# EasyEDA Pro project ProPrj_MN42_2025-04-03.epro, board btnBRD
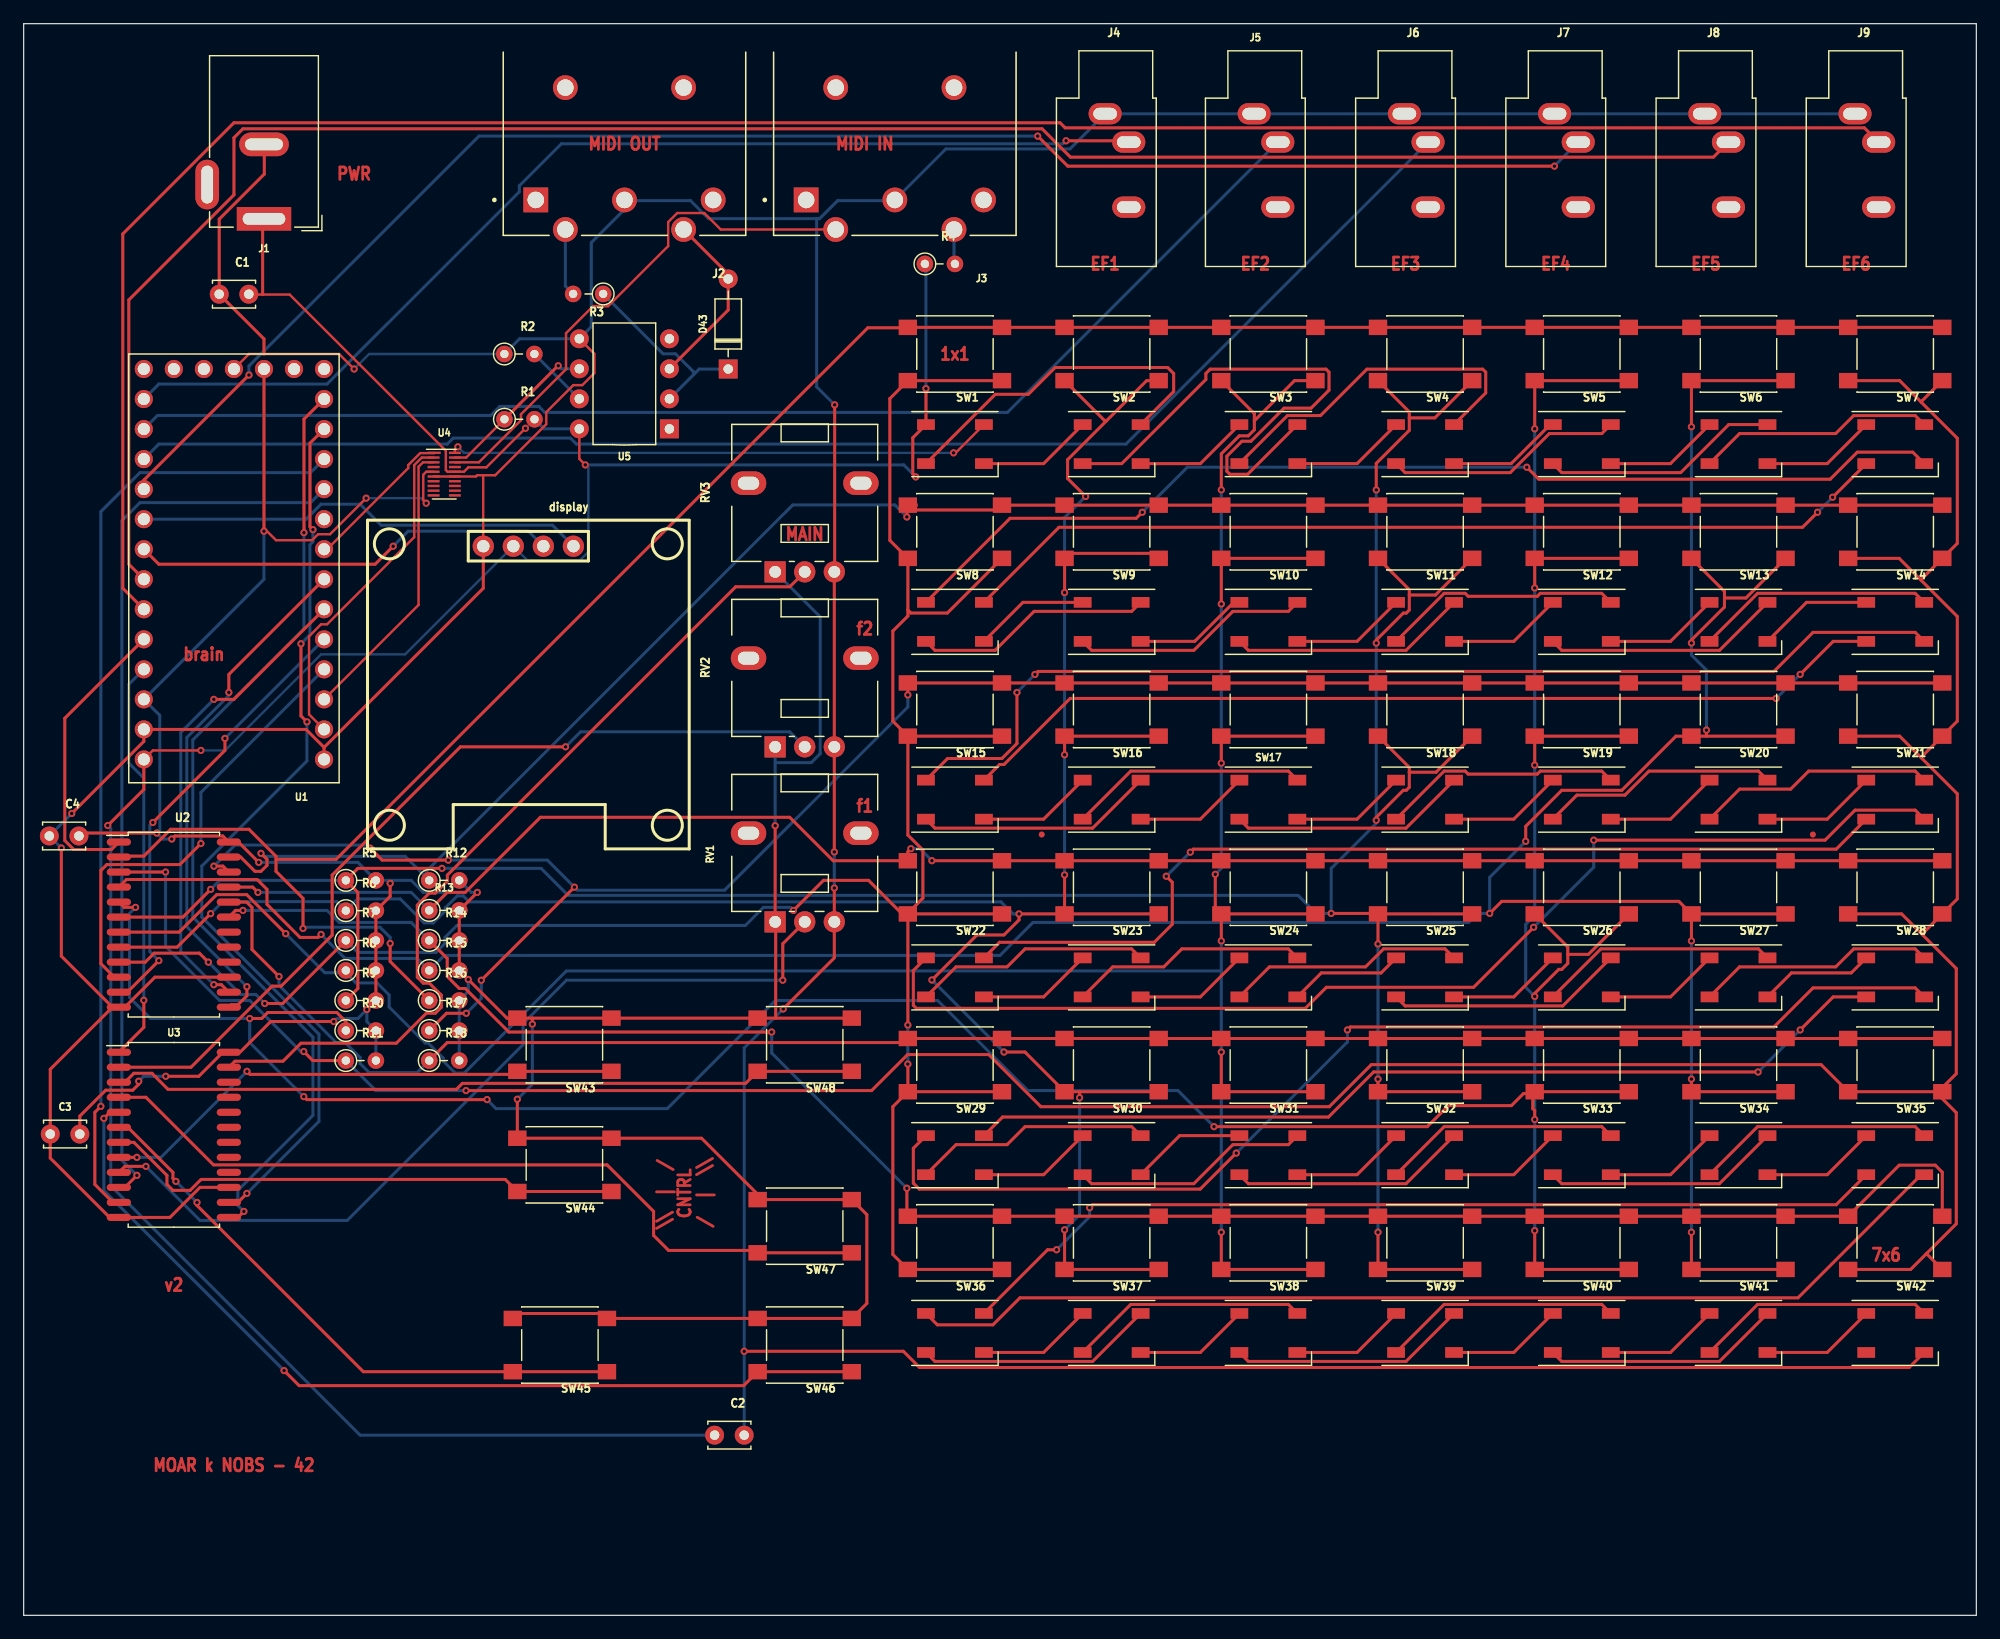
[diagram p1: board, top side]
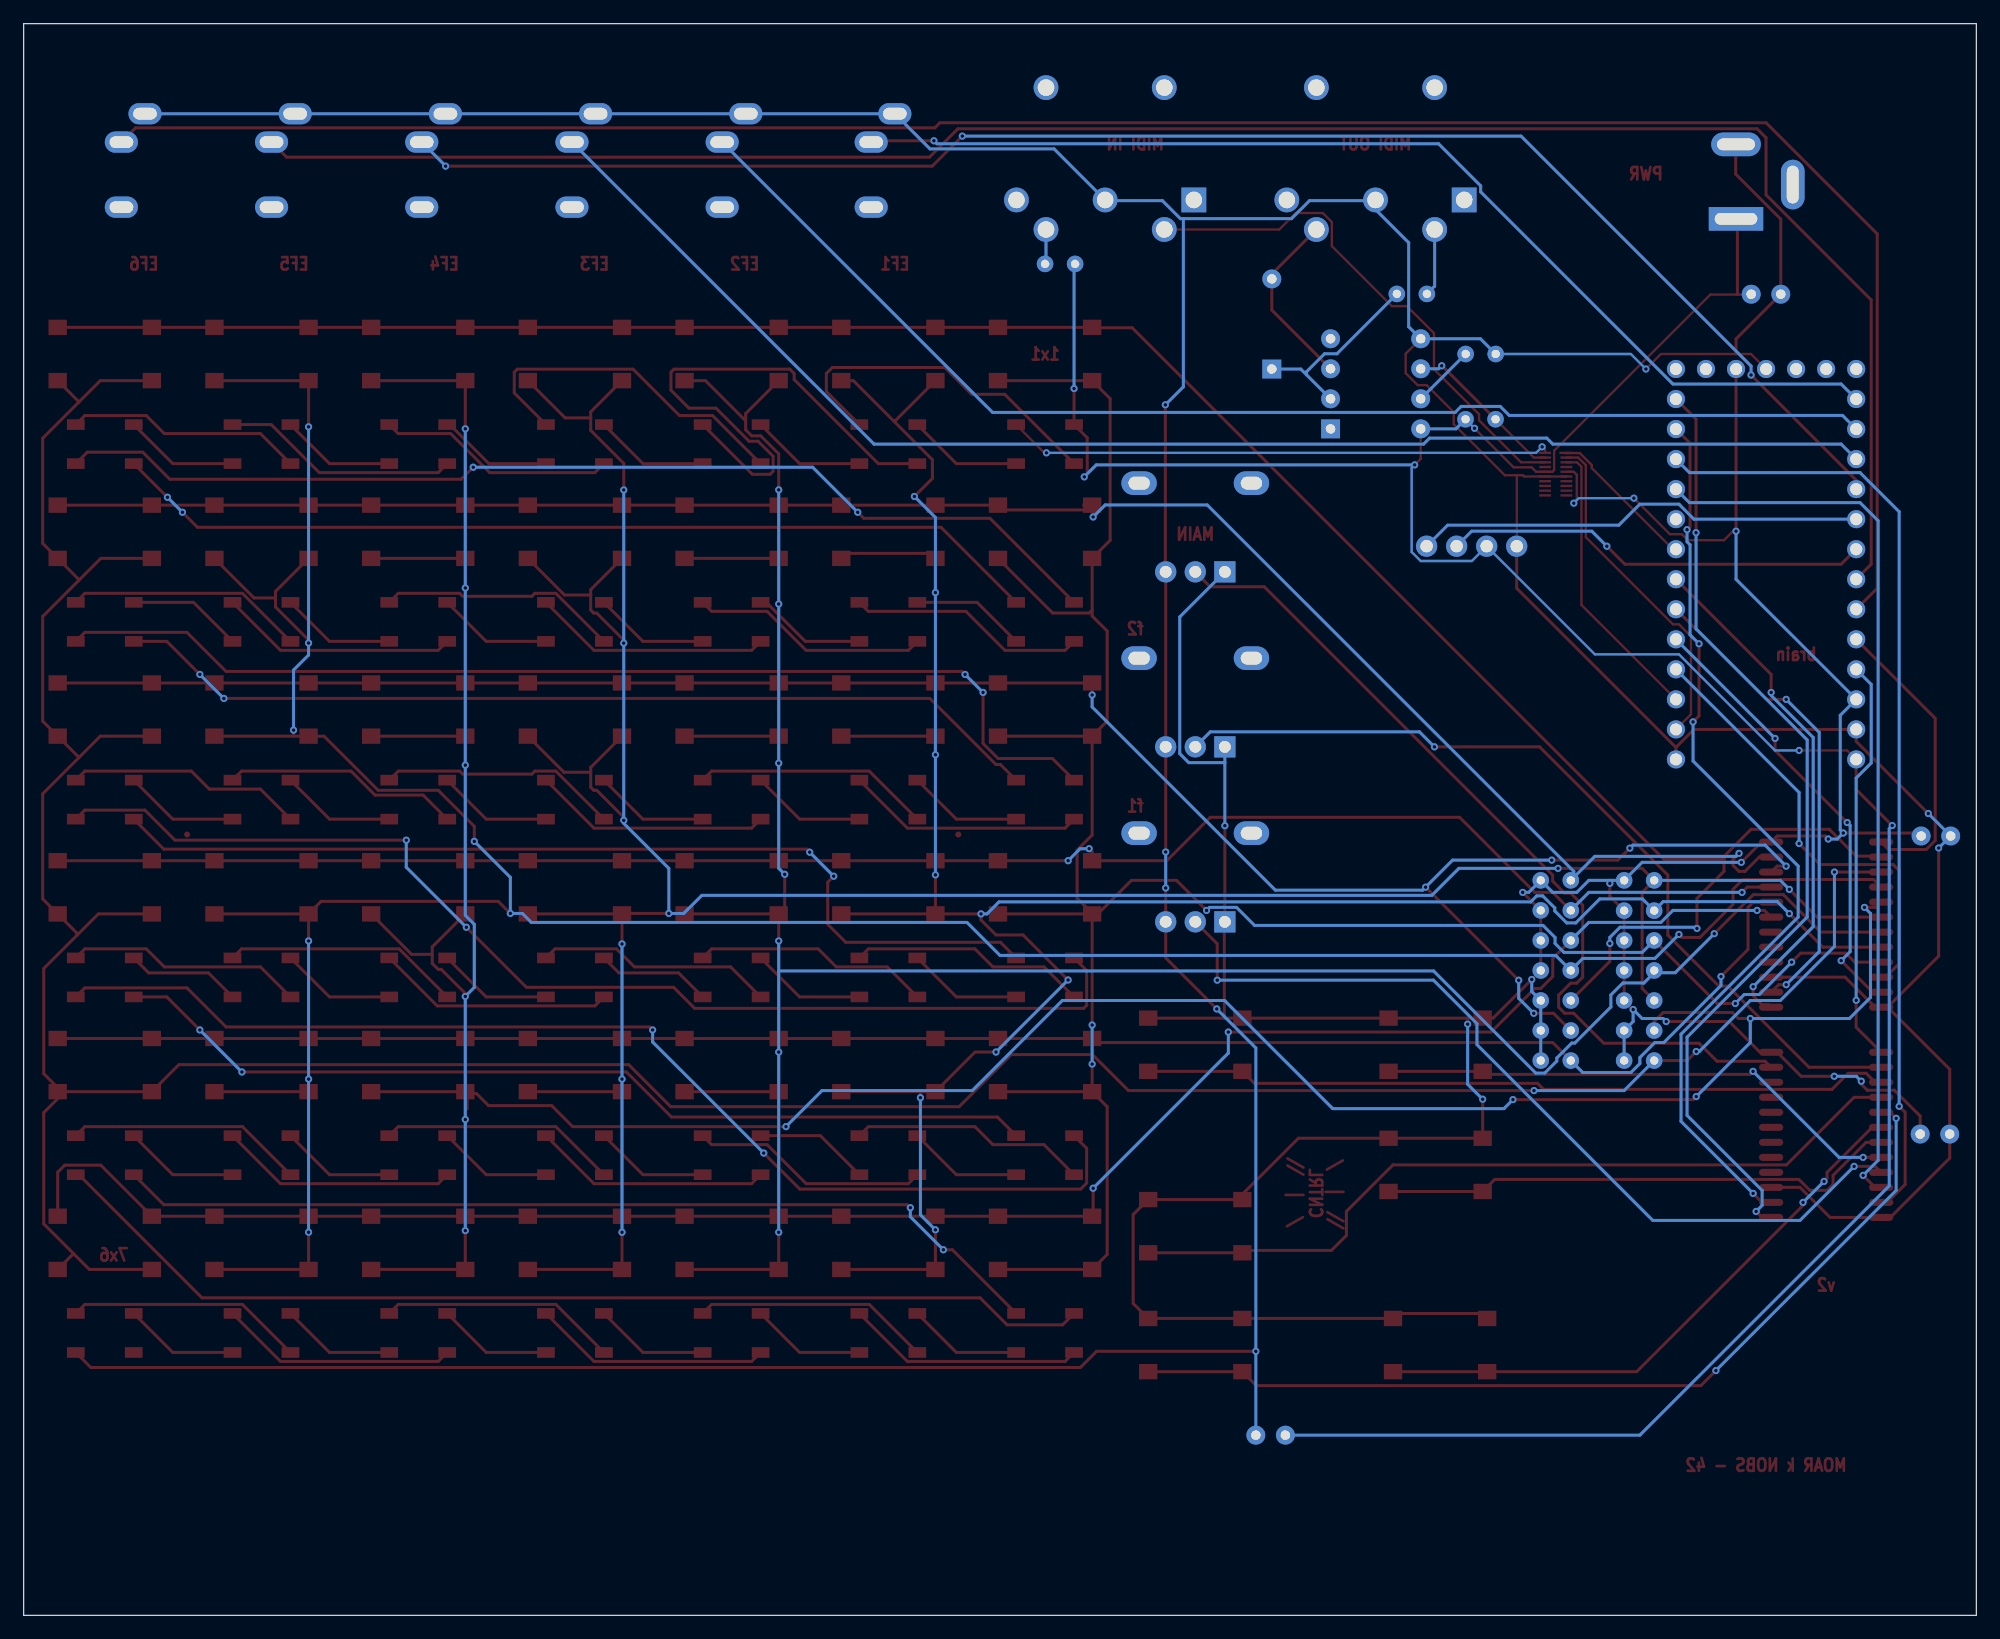
[diagram p2: board, bottom side, seen from below]

Outline 165.1 x 134.62 mm; copper layers: Top Layer, Bottom Layer. Coordinates in mm from the lower left corner of the outline.
Outline path: 0,134.62 0,0 165.1,0 165.1,134.62 0,134.62
Stack: Top Layer 0.035mm / Dielectric1 1.51mm FR4 er 4.5 / Bottom Layer 0.035mm

## Design rules (mm)
spacing safeClearance (default): track to track 0.152, other pairs 0.152 to 0.3
track width trackWidth (default): min 0.127, default 0.254, max 2.54
differential pair differentialPair (default): width min 0.127, default 0.254, max 2.54; gap min 0.152, default 0.152
via viaSize (default): diameter min 0.5, default 0.61, max 10; hole min 0.3, default 0.305, max 6

## Placement (name value [footprint] x y rotation side)
C1  10uF  [Capacitor_THT:C_Disc_D3.4mm_W2.1mm_P2.50mm]  16.54 111.74 0 top
C2  470uF  [Capacitor_THT:C_Disc_D3.4mm_W2.1mm_P2.50mm]  58.42 15.24 0 top
C3  100nF  [Capacitor_THT:C_Disc_D3.4mm_W2.1mm_P2.50mm]  2.25 40.71 0 top
C4  100nF  [Capacitor_THT:C_Disc_D3.4mm_W2.1mm_P2.50mm]  2.17 65.92 0 top
D1  WS2812B  [LED_SMD:LED_WS2812B_PLCC4_5.0x5.0mm_P3.2mm]  78.74 99.06 0 top
D2  WS2812B  [LED_SMD:LED_WS2812B_PLCC4_5.0x5.0mm_P3.2mm]  91.99 99.06 0 top
D3  WS2812B  [LED_SMD:LED_WS2812B_PLCC4_5.0x5.0mm_P3.2mm]  105.24 99.06 0 top
D4  WS2812B  [LED_SMD:LED_WS2812B_PLCC4_5.0x5.0mm_P3.2mm]  118.49 99.06 0 top
D5  WS2812B  [LED_SMD:LED_WS2812B_PLCC4_5.0x5.0mm_P3.2mm]  131.74 99.06 0 top
D6  WS2812B  [LED_SMD:LED_WS2812B_PLCC4_5.0x5.0mm_P3.2mm]  144.99 99.06 0 top
D7  WS2812B  [LED_SMD:LED_WS2812B_PLCC4_5.0x5.0mm_P3.2mm]  158.24 99.06 0 top
D8  WS2812B  [LED_SMD:LED_WS2812B_PLCC4_5.0x5.0mm_P3.2mm]  78.74 84.03 0 top
D9  WS2812B  [LED_SMD:LED_WS2812B_PLCC4_5.0x5.0mm_P3.2mm]  91.99 84.03 0 top
D10  WS2812B  [LED_SMD:LED_WS2812B_PLCC4_5.0x5.0mm_P3.2mm]  105.24 84.03 0 top
D11  WS2812B  [LED_SMD:LED_WS2812B_PLCC4_5.0x5.0mm_P3.2mm]  118.49 84.03 0 top
D12  WS2812B  [LED_SMD:LED_WS2812B_PLCC4_5.0x5.0mm_P3.2mm]  131.74 84.03 0 top
D13  WS2812B  [LED_SMD:LED_WS2812B_PLCC4_5.0x5.0mm_P3.2mm]  144.99 84.03 0 top
D14  WS2812B  [LED_SMD:LED_WS2812B_PLCC4_5.0x5.0mm_P3.2mm]  158.24 84.03 0 top
D15  WS2812B  [LED_SMD:LED_WS2812B_PLCC4_5.0x5.0mm_P3.2mm]  78.74 68.99 0 top
D16  WS2812B  [LED_SMD:LED_WS2812B_PLCC4_5.0x5.0mm_P3.2mm]  91.99 68.99 0 top
D17  WS2812B  [LED_SMD:LED_WS2812B_PLCC4_5.0x5.0mm_P3.2mm]  105.24 68.99 0 top
D18  WS2812B  [LED_SMD:LED_WS2812B_PLCC4_5.0x5.0mm_P3.2mm]  118.49 68.99 0 top
D19  WS2812B  [LED_SMD:LED_WS2812B_PLCC4_5.0x5.0mm_P3.2mm]  131.74 68.99 0 top
D20  WS2812B  [LED_SMD:LED_WS2812B_PLCC4_5.0x5.0mm_P3.2mm]  144.99 68.99 0 top
D21  WS2812B  [LED_SMD:LED_WS2812B_PLCC4_5.0x5.0mm_P3.2mm]  158.24 68.99 0 top
D22  WS2812B  [LED_SMD:LED_WS2812B_PLCC4_5.0x5.0mm_P3.2mm]  78.74 53.96 0 top
D23  WS2812B  [LED_SMD:LED_WS2812B_PLCC4_5.0x5.0mm_P3.2mm]  91.99 53.96 0 top
D24  WS2812B  [LED_SMD:LED_WS2812B_PLCC4_5.0x5.0mm_P3.2mm]  105.24 53.96 0 top
D25  WS2812B  [LED_SMD:LED_WS2812B_PLCC4_5.0x5.0mm_P3.2mm]  118.49 53.96 0 top
D26  WS2812B  [LED_SMD:LED_WS2812B_PLCC4_5.0x5.0mm_P3.2mm]  131.74 53.96 0 top
D27  WS2812B  [LED_SMD:LED_WS2812B_PLCC4_5.0x5.0mm_P3.2mm]  144.99 53.96 0 top
D28  WS2812B  [LED_SMD:LED_WS2812B_PLCC4_5.0x5.0mm_P3.2mm]  158.24 53.96 0 top
D29  WS2812B  [LED_SMD:LED_WS2812B_PLCC4_5.0x5.0mm_P3.2mm]  78.74 38.92 0 top
D30  WS2812B  [LED_SMD:LED_WS2812B_PLCC4_5.0x5.0mm_P3.2mm]  91.99 38.92 0 top
D31  WS2812B  [LED_SMD:LED_WS2812B_PLCC4_5.0x5.0mm_P3.2mm]  105.24 38.92 0 top
D32  WS2812B  [LED_SMD:LED_WS2812B_PLCC4_5.0x5.0mm_P3.2mm]  118.49 38.92 0 top
D33  WS2812B  [LED_SMD:LED_WS2812B_PLCC4_5.0x5.0mm_P3.2mm]  131.74 38.92 0 top
D34  WS2812B  [LED_SMD:LED_WS2812B_PLCC4_5.0x5.0mm_P3.2mm]  144.99 38.92 0 top
D35  WS2812B  [LED_SMD:LED_WS2812B_PLCC4_5.0x5.0mm_P3.2mm]  158.24 38.92 0 top
D36  WS2812B  [LED_SMD:LED_WS2812B_PLCC4_5.0x5.0mm_P3.2mm]  78.74 23.89 0 top
D37  WS2812B  [LED_SMD:LED_WS2812B_PLCC4_5.0x5.0mm_P3.2mm]  91.99 23.89 0 top
D38  WS2812B  [LED_SMD:LED_WS2812B_PLCC4_5.0x5.0mm_P3.2mm]  105.24 23.89 0 top
D39  WS2812B  [LED_SMD:LED_WS2812B_PLCC4_5.0x5.0mm_P3.2mm]  118.49 23.89 0 top
D40  WS2812B  [LED_SMD:LED_WS2812B_PLCC4_5.0x5.0mm_P3.2mm]  131.74 23.89 0 top
D41  WS2812B  [LED_SMD:LED_WS2812B_PLCC4_5.0x5.0mm_P3.2mm]  144.99 23.89 0 top
D42  WS2812B  [LED_SMD:LED_WS2812B_PLCC4_5.0x5.0mm_P3.2mm]  158.24 23.89 0 top
D43  1N4148  [Diode_THT:D_DO-35_SOD27_P7.62mm_Horizontal]  59.57 105.41 90 top
display  HS96L03W2C03  [OLED-TH_L27.8-W27.2-P2.54_C9900033791]  42.67 90.42 0 top
J1  Jack-DC  [Connector_BarrelJack:BarrelJack_GCT_DCJ200-10-A_Horizontal]  20.32 118.11 180 top
J2  MIDI-IN  [midiJack:KYCON_KCDX-5S-N]  50.8 124.46 180 top
J3  MIDI-OUT  [midiJack:KYCON_KCDX-5S-N]  73.66 124.46 180 top
J4  AudioJack2  [Connector_Audio:Jack_3.5mm_CUI_SJ1-3533NG_Horizontal]  91.44 127 0 top
J5  AudioJack2  [Connector_Audio:Jack_3.5mm_CUI_SJ1-3533NG_Horizontal]  104.04 127 0 top
J6  AudioJack2  [Connector_Audio:Jack_3.5mm_CUI_SJ1-3533NG_Horizontal]  116.74 127 0 top
J7  AudioJack2  [Connector_Audio:Jack_3.5mm_CUI_SJ1-3533NG_Horizontal]  129.44 127 0 top
J8  AudioJack2  [Connector_Audio:Jack_3.5mm_CUI_SJ1-3533NG_Horizontal]  142.14 127 0 top
J9  AudioJack2  [Connector_Audio:Jack_3.5mm_CUI_SJ1-3533NG_Horizontal]  154.84 127 0 top
R1  220  [Resistor_THT:R_Axial_DIN0204_L3.6mm_D1.6mm_P2.54mm_Vertical]  40.65 101.16 0 top
R2  4.7k  [Resistor_THT:R_Axial_DIN0204_L3.6mm_D1.6mm_P2.54mm_Vertical]  40.64 106.68 0 top
R3  220  [Resistor_THT:R_Axial_DIN0204_L3.6mm_D1.6mm_P2.54mm_Vertical]  49 111.76 180 top
R4  220  [Resistor_THT:R_Axial_DIN0204_L3.6mm_D1.6mm_P2.54mm_Vertical]  76.2 114.3 0 top
R5  10k  [Resistor_THT:R_Axial_DIN0204_L3.6mm_D1.6mm_P2.54mm_Vertical]  27.24 62.16 0 top
R6  10k  [Resistor_THT:R_Axial_DIN0204_L3.6mm_D1.6mm_P2.54mm_Vertical]  27.24 59.6 0 top
R7  10k  [Resistor_THT:R_Axial_DIN0204_L3.6mm_D1.6mm_P2.54mm_Vertical]  27.24 57.08 0 top
R8  10k  [Resistor_THT:R_Axial_DIN0204_L3.6mm_D1.6mm_P2.54mm_Vertical]  27.24 54.54 0 top
R9  10k  [Resistor_THT:R_Axial_DIN0204_L3.6mm_D1.6mm_P2.54mm_Vertical]  27.24 52 0 top
R10  10k  [Resistor_THT:R_Axial_DIN0204_L3.6mm_D1.6mm_P2.54mm_Vertical]  27.24 49.46 0 top
R11  10k  [Resistor_THT:R_Axial_DIN0204_L3.6mm_D1.6mm_P2.54mm_Vertical]  27.24 46.92 0 top
R12  10k  [Resistor_THT:R_Axial_DIN0204_L3.6mm_D1.6mm_P2.54mm_Vertical]  34.29 62.16 0 top
R13  10k  [Resistor_THT:R_Axial_DIN0204_L3.6mm_D1.6mm_P2.54mm_Vertical]  34.29 59.62 0 top
R14  10k  [Resistor_THT:R_Axial_DIN0204_L3.6mm_D1.6mm_P2.54mm_Vertical]  34.29 57.08 0 top
R15  10k  [Resistor_THT:R_Axial_DIN0204_L3.6mm_D1.6mm_P2.54mm_Vertical]  34.29 54.54 0 top
R16  10k  [Resistor_THT:R_Axial_DIN0204_L3.6mm_D1.6mm_P2.54mm_Vertical]  34.29 52 0 top
R17  10k  [Resistor_THT:R_Axial_DIN0204_L3.6mm_D1.6mm_P2.54mm_Vertical]  34.29 49.46 0 top
R18  10k  [Resistor_THT:R_Axial_DIN0204_L3.6mm_D1.6mm_P2.54mm_Vertical]  34.29 46.92 0 top
RV1  10k - ff  [Potentiometer_THT:Potentiometer_Alps_RK09L_Single_Vertical]  63.54 58.66 90 top
RV2  10k - q  [Potentiometer_THT:Potentiometer_Alps_RK09L_Single_Vertical]  63.54 73.46 90 top
RV3  10k - main  [Potentiometer_THT:Potentiometer_Alps_RK09L_Single_Vertical]  63.54 88.26 90 top
SW1  1x1  [Button_Switch_SMD:SW_SPST_PTS645]  78.74 106.68 180 top
SW2  2x1  [Button_Switch_SMD:SW_SPST_PTS645]  91.99 106.68 180 top
SW3  3x1  [Button_Switch_SMD:SW_SPST_PTS645]  105.24 106.68 180 top
SW4  4x1  [Button_Switch_SMD:SW_SPST_PTS645]  118.49 106.68 180 top
SW5  5x1  [Button_Switch_SMD:SW_SPST_PTS645]  131.74 106.68 180 top
SW6  6x1  [Button_Switch_SMD:SW_SPST_PTS645]  144.99 106.68 180 top
SW7  7x1  [Button_Switch_SMD:SW_SPST_PTS645]  158.24 106.68 180 top
SW8  1x2  [Button_Switch_SMD:SW_SPST_PTS645]  78.74 91.65 180 top
SW9  2x2  [Button_Switch_SMD:SW_SPST_PTS645]  91.99 91.65 180 top
SW10  3x2  [Button_Switch_SMD:SW_SPST_PTS645]  105.24 91.65 180 top
SW11  4x2  [Button_Switch_SMD:SW_SPST_PTS645]  118.49 91.65 180 top
SW12  5x2  [Button_Switch_SMD:SW_SPST_PTS645]  131.74 91.65 180 top
SW13  6x2  [Button_Switch_SMD:SW_SPST_PTS645]  144.99 91.65 180 top
SW14  7x2  [Button_Switch_SMD:SW_SPST_PTS645]  158.24 91.65 180 top
SW15  1x3  [Button_Switch_SMD:SW_SPST_PTS645]  78.74 76.61 180 top
SW16  2x3  [Button_Switch_SMD:SW_SPST_PTS645]  91.99 76.61 180 top
SW17  3x3  [Button_Switch_SMD:SW_SPST_PTS645]  105.24 76.61 180 top
SW18  4x3  [Button_Switch_SMD:SW_SPST_PTS645]  118.49 76.61 180 top
SW19  5x3  [Button_Switch_SMD:SW_SPST_PTS645]  131.74 76.61 180 top
SW20  6x3  [Button_Switch_SMD:SW_SPST_PTS645]  144.99 76.61 180 top
SW21  7x3  [Button_Switch_SMD:SW_SPST_PTS645]  158.24 76.61 180 top
SW22  1x4  [Button_Switch_SMD:SW_SPST_PTS645]  78.74 61.58 180 top
SW23  2x4  [Button_Switch_SMD:SW_SPST_PTS645]  91.99 61.58 180 top
SW24  3x4  [Button_Switch_SMD:SW_SPST_PTS645]  105.24 61.58 180 top
SW25  4x4  [Button_Switch_SMD:SW_SPST_PTS645]  118.49 61.58 180 top
SW26  5x4  [Button_Switch_SMD:SW_SPST_PTS645]  131.74 61.58 180 top
SW27  6x4  [Button_Switch_SMD:SW_SPST_PTS645]  144.99 61.58 180 top
SW28  7x4  [Button_Switch_SMD:SW_SPST_PTS645]  158.24 61.58 180 top
SW29  1x5  [Button_Switch_SMD:SW_SPST_PTS645]  78.74 46.54 180 top
SW30  2x5  [Button_Switch_SMD:SW_SPST_PTS645]  91.99 46.54 180 top
SW31  3x5  [Button_Switch_SMD:SW_SPST_PTS645]  105.24 46.54 180 top
SW32  4x5  [Button_Switch_SMD:SW_SPST_PTS645]  118.49 46.54 180 top
SW33  5x5  [Button_Switch_SMD:SW_SPST_PTS645]  131.74 46.54 180 top
SW34  6x5  [Button_Switch_SMD:SW_SPST_PTS645]  144.99 46.54 180 top
SW35  7x5  [Button_Switch_SMD:SW_SPST_PTS645]  158.24 46.54 180 top
SW36  1x6  [Button_Switch_SMD:SW_SPST_PTS645]  78.74 31.51 180 top
SW37  2x6  [Button_Switch_SMD:SW_SPST_PTS645]  91.99 31.51 180 top
SW38  3x6  [Button_Switch_SMD:SW_SPST_PTS645]  105.24 31.51 180 top
SW39  4x6  [Button_Switch_SMD:SW_SPST_PTS645]  118.49 31.51 180 top
SW40  5x6  [Button_Switch_SMD:SW_SPST_PTS645]  131.74 31.51 180 top
SW41  6x6  [Button_Switch_SMD:SW_SPST_PTS645]  144.99 31.51 180 top
SW42  7x6  [Button_Switch_SMD:SW_SPST_PTS645]  158.24 31.51 180 top
SW43  cntrl1  [Button_Switch_SMD:SW_SPST_PTS645]  45.72 48.26 180 top
SW44  cntrl2  [Button_Switch_SMD:SW_SPST_PTS645]  45.72 38.1 180 top
SW45  cntrl3  [Button_Switch_SMD:SW_SPST_PTS645]  45.34 22.86 180 top
SW46  cntrl4  [Button_Switch_SMD:SW_SPST_PTS645]  66.04 22.86 180 top
SW47  cntrl5  [Button_Switch_SMD:SW_SPST_PTS645]  66.04 32.91 180 top
SW48  cntrl6  [Button_Switch_SMD:SW_SPST_PTS645]  66.04 48.26 180 top
U1  brain - teensy 4.0  [teensy 4.0:MODULE_DEV-15583]  17.78 88.9 180 top
U2  digital mux - 74hc4067m  [Package_SO:SOIC-24W_7.5x15.4mm_P1.27mm]  12.7 58.42 0 top
U3  analog mux - 74hc4067m  [Package_SO:SOIC-24W_7.5x15.4mm_P1.27mm]  12.7 40.64 0 top
U4  TXB0108DQSR  [Package_SON:USON-20_2x4mm_P0.4mm]  35.56 96.52 0 top
U5  6N138  [Package_DIP:DIP-8_W7.62mm]  54.6 100.35 180 top

## Footprints (pads in the part's own frame, mm; a bottom-side part is the same pattern mirrored in y, then rotated)
Button_Switch_SMD:SW_SPST_PTS645
  rect 1.55x1.3 smd: 1(-3.98,2.25) 1(3.98,2.25) 2(-3.98,-2.25) 2(3.98,-2.25)
Capacitor_THT:C_Disc_D3.4mm_W2.1mm_P2.50mm
  round 1.6 hole 0.8: 1(0,0) 2(2.5,0)
Connector_Audio:Jack_3.5mm_CUI_SJ1-3533NG_Horizontal
  oval 2.8x1.8 hole 2x1: R(2,-7.9) S(0,0) T(2,-2.4)
Connector_BarrelJack:BarrelJack_GCT_DCJ200-10-A_Horizontal
  rect 4.6x2 hole 3.6x1: 1(0,0)
  oval 4.2x2 hole 3.2x1: 2(0,-6.3)
  oval 2x4.2 hole 1x3.2: 3(4.8,-2.9)
Diode_THT:D_DO-35_SOD27_P7.62mm_Horizontal
  rect 1.6x1.6 hole 0.8: 1(0,0)
  round 1.6 hole 0.8: 2(7.62,0)
LED_SMD:LED_WS2812B_PLCC4_5.0x5.0mm_P3.2mm
  rect 1.5x0.9 smd: 1(-2.45,1.65) 2(-2.45,-1.65) 3(2.45,-1.65) 4(2.45,1.65)
midiJack:KYCON_KCDX-5S-N
  rect 2.1x2.1 hole 1.4: 1(7.5,4.75)
  round 2.1 hole 1.4: 2(0,4.75) 3(-7.5,4.75) 4(5,7.25) 5(-5,7.25) G1(-5,-4.75) G2(5,-4.75)
OLED-TH_L27.8-W27.2-P2.54_C9900033791
  round 1.8 hole 1.05: 1(-3.81,0) 2(-1.27,0) 3(1.27,0) 4(3.81,0)
Package_DIP:DIP-8_W7.62mm
  rect 1.6x1.6 hole 0.8: 1(0,0)
  round 1.6 hole 0.8: 2(0,-2.54) 3(0,-5.08) 4(0,-7.62) 5(7.62,-7.62) 6(7.62,-5.08) 7(7.62,-2.54) 8(7.62,0)
Package_SO:SOIC-24W_7.5x15.4mm_P1.27mm
  rrect 2.05x0.6 smd: 1(-4.65,6.985) 2(-4.65,5.715) 3(-4.65,4.445) 4(-4.65,3.175) 5(-4.65,1.905) 6(-4.65,0.635) 7(-4.65,-0.635) 8(-4.65,-1.905) 9(-4.65,-3.175) 10(-4.65,-4.445) 11(-4.65,-5.715) 12(-4.65,-6.985) 13(4.65,-6.985) 14(4.65,-5.715) 15(4.65,-4.445) 16(4.65,-3.175) 17(4.65,-1.905) 18(4.65,-0.635) 19(4.65,0.635) 20(4.65,1.905) 21(4.65,3.175) 22(4.65,4.445) 23(4.65,5.715) 24(4.65,6.985)
Package_SON:USON-20_2x4mm_P0.4mm
  rect 1.1x0.2 smd: 1(-0.85,1.8)
  rect 1x0.2 smd: 2(-0.9,1.4) 3(-0.9,1) 4(-0.9,0.6) 5(-0.9,0.2) 6(-0.9,-0.2) 7(-0.9,-0.6) 8(-0.9,-1) 9(-0.9,-1.4) 10(-0.9,-1.8) 11(0.9,-1.8) 12(0.9,-1.4) 13(0.9,-1) 14(0.9,-0.6) 15(0.9,-0.2) 16(0.9,0.2) 17(0.9,0.6) 18(0.9,1) 19(0.9,1.4) 20(0.9,1.8)
Potentiometer_THT:Potentiometer_Alps_RK09L_Single_Vertical
  rect 1.8x1.8 hole 1: 1(0,0)
  round 1.8 hole 1: 2(0,-2.5) 3(0,-5)
  rrect 2x3 hole 1.1x1.8: MP(7.5,2.25) MP(7.5,-7.25)
Resistor_THT:R_Axial_DIN0204_L3.6mm_D1.6mm_P2.54mm_Vertical
  round 1.4 hole 0.7: 1(0,0) 2(2.54,0)
teensy 4.0:MODULE_DEV-15583
  round 1.53 hole 1.02: 0(-7.62,13.97) 1(-7.62,11.43) 2(-7.62,8.89) 3(-7.62,6.35) 3.3V_1(-2.54,-16.51) 3.3V_2(7.62,11.43) 4(-7.62,3.81) 5(-7.62,1.27) 6(-7.62,-1.27) 7(-7.62,-3.81) 8(-7.62,-6.35) 9(-7.62,-8.89) 10(-7.62,-11.43) 11(-7.62,-13.97) 12(-7.62,-16.51) 13(7.62,-16.51) 14(7.62,-13.97) 15(7.62,-11.43) 16(7.62,-8.89) 17(7.62,-6.35) 18(7.62,-3.81) 19(7.62,-1.27) 20(7.62,1.27) 21(7.62,3.81) 22(7.62,6.35) 23(7.62,8.89) G1(-7.62,16.51) G2(0,-16.51) G3(7.62,13.97) ON-OFF(5.08,-16.51) PGM(2.54,-16.51) VBAT(-5.08,-16.51) VIN(7.62,16.51)

## Nets
As in the schematic, except:
5VDC: C1.2 C2.1 D1.1 display.2 J1.1 R1.2 R4.1 U1.VIN U4.16 U5.8
GND: C1.1 C2.2 C3.1 C4.1 D42.3 display.1 J1.2 J2.2 J3.2 J4.S J5.S J6.S J7.S J8.S J9.S R2.1 RV1.3 RV2.3 RV3.3 U1.G1 U1.G2 U1.G3 U2.12 U2.15 U3.12 U3.15 U4.6 U4.15 U5.5
SCL: display.3 U1.19
SDA: display.4 U1.18

Pads without a net: D42 2; J1 3; J2 1 3 G1 G2; J3 1 3 G1 G2; J4 R; J5 R; J6 R; J7 R; J8 R; J9 R; RV1 MP; RV2 MP; RV3 MP; U1 7 12 13 ON-OFF PGM VBAT; U2 16 17 18; U3 16 17 18 19 20 21 22; U4 4 7 8 9 10 11 12 13 14 17; U5 1 4

## Via types
v1: diameter 0.61, hole 0.305, Top Layer to Bottom Layer, 155 vias

## Routing (per net, layer and track width the routed paths; a pad name or vN(x,y) marks a point on that pad's centre or on a via; arc(x,y) is an arc through that point)
3VDC: length 321.7
  Top Layer w0.2: v1(28.96,94.49) 25.91,91.44 24.89,91.44 24.38,90.93 21.34,90.93 20.32,91.95 ; U4.5 34.04,96.72 33.78,96.47 33.78,94.32 v1(34.04,94.06)
  Top Layer w0.254: v1(20.32,91.69) U1.3.3V_1 ; v1(12.52,65.66) 12.78,65.91 16.84,65.91 U2.24 18.16,65.41 v1(19.87,63.69) ; C3.2 4.75,42.23 6.94,44.42 9.22,44.42 9.73,44.92 v1(9.73,45.18) ; v1(41.74,43.65) SW44.2 SW44.2 57.32,40.35 61.89,35.78 61.89,35.33 SW47.2 SW47.2 71.29,33.89 71.29,26.38 SW46.2 SW46.2 SW45.2 48.9,25.53 41.19,25.53 41.11,25.45 41.11,25.36 SW45.2 ; v1(26.22,50.22) 20.89,50.22 18.35,47.68 17.41,47.68 U3.24 16.84,47.63 14.81,45.59 v1(12.02,45.59) ; 43.01,50.51 SW43.2 40.86,50.51 v1(37.59,53.78) R15.2 R14.2 R13.2 v1(38.35,61.15) ; 43.01,50.51 SW43.2 SW48.2 63.58,50.51 ; 43.01,50.51 v1(43.01,50) ; 63.58,50.51 SW48.2 ; 63.58,50.51 63.58,58.61 RV1.1 v1(63.54,66.78) ; C4.2 4.92,66.17 v1(11.25,66.17) ; v1(29.02,51.24) R9.2 R8.2 R7.2 R6.2 30.99,60.81 v1(30.99,61.91)
  Bottom Layer w0.2: v1(34.04,94.06) 33.61,94.49 v1(28.96,94.49)
  Bottom Layer w0.254: v1(19.87,63.69) 28.26,63.69 R5.2 30.99,62.16 ; 30.99,62.16 v1(30.99,61.91) ; 30.99,62.16 32.77,62.16 33.78,61.15 35.81,61.15 R12.2 37.85,61.15 v1(38.35,61.15) ; v1(63.54,66.78) 63.54,72.12 ; 63.54,72.12 RV2.1 ; 63.54,72.12 66.59,72.12 67.35,72.88 67.35,84.45 RV3.1 ; v1(26.22,50.22) 26.48,50.48 28.26,50.48 v1(29.02,51.24) 29.02,50.22 R10.2 R11.2 ; v1(9.73,45.18) 10.15,45.59 v1(12.02,45.59) ; v1(12.52,65.66) 11.76,65.66 v1(11.25,66.17) 11.51,66.42 11.51,76.12 U1.3.3V_2 20.32,87.63 v1(20.32,91.69) ; v1(41.74,43.65) 43.01,44.92 v1(43.01,50) ; R18.2 R17.2 R16.2 37.59,52.76 v1(37.59,53.78)
5VDC: length 244.6
  Top Layer w0.2: C1.2 19.07,111.71 22.49,111.71 35.7,98.5 35.7,96.87 35.84,96.72 U4.16 37.23,96.72 37.6,97.1 39.13,97.1 v1(42.43,100.4) ; U5.8 46.98,97.81 v1(47.49,97.3) ; U1.VIN 10.92,73.15 v1(14.99,73.15)
  Top Layer w0.254: v1(7.11,66.8) 10.16,69.85 U1.VIN ; v1(75.43,96.29) 75.17,96.54 75.17,99.59 D1.1 v1(76.29,103.76) ; 20.2,111.71 20.2,117.99 J1.1
  Bottom Layer w0.2: v1(47.49,97.3) 47.74,97.05 47.74,89.94 46.98,89.17 42.65,89.17 display.2 32.26,81.28 25.15,81.28 17.02,73.15 v1(14.99,73.15) ; R1.2 v1(42.43,100.4)
  Bottom Layer w0.254: R4.1 76.29,114.21 v1(76.29,103.76) ; v1(47.49,97.3) 74.41,97.3 v1(75.43,96.29) ; U5.8 44,100.35 R1.2 ; C2.1 28.45,15.24 7.37,36.32 7.37,66.55 v1(7.11,66.8)
GND: length 521.2
  Top Layer w0.2: display.1 38.85,90.43 38.85,96.43 ; U4.6 U4.15 38.24,96.32 38.34,96.43 38.85,96.43 ; v1(27.94,105.41) 26.67,106.68 19.05,106.68 U1.G2 ; 38.85,96.43 39.87,96.43 44.19,100.74 44.19,101.76 46.47,104.05 47.23,104.05 48.25,105.06 48.25,106.7 U5.5
  Top Layer w0.254: 20.32,106.68 20.32,107.95 C1.1 16.54,118.09 20.35,121.9 20.35,124.38 J1.2 ; 7.5,51.44 2.25,46.18 C3.1 2.25,38.67 7.27,33.66 U3.12 12.37,33.66 14.91,36.2 U3.15 ; 7.5,51.44 3.19,55.76 v1(3.19,64.9) ; 7.5,51.44 U2.12 8.56,51.44 11.1,53.98 U2.15 ; v1(64.22,51.29) 68.54,55.61 RV1.3 v1(68.54,61.52) ; 25.4,73.41 23.88,74.93 U1.G3 10.16,73.91 v1(4.06,67.82) ; 25.4,73.41 38.86,86.87 display.1 ; 25.4,73.41 U1.G1 ; v1(60.92,22.33) 74.38,22.33 75.75,20.97 159.42,20.97 D42.3 ; v1(68.54,64.57) RV2.3 RV3.3 68.57,88.29 v1(68.57,102.38)
  Bottom Layer w0.2: v1(27.94,105.41) 29.21,106.68 R2.1
  Bottom Layer w0.254: J9.S J8.S J7.S J6.S J5.S J4.S 88.47,124.03 77.98,124.03 J3.2 73.6,119.65 68.82,119.65 67.3,118.13 67.05,118.13 ; v1(3.19,64.9) C4.1 v1(4.06,67.82) ; 67.05,118.13 67.05,103.91 v1(68.57,102.38) ; 67.05,118.13 57.9,118.13 56.38,119.65 50.79,119.65 ; 50.79,119.65 J2.2 ; 50.79,119.65 50.79,118.89 48,116.1 48,108.99 U5.5 41.93,107.97 R2.1 ; v1(68.54,64.57) v1(68.54,61.52) ; v1(64.22,51.29) 60.92,47.99 v1(60.92,22.33) C2.2
COL1: length 196.2
  Top Layer w0.254: 21.34,63.94 21.34,64.19 19.05,66.48 12.43,66.48 10.16,64.21 8.13,64.21 U2.2 ; 21.34,63.94 21.34,62.92 23.62,60.64 v1(23.62,58.1) ; 21.34,63.94 26.42,63.94 71.37,108.9 74.73,108.9 SW1.2 SW1.2 SW2.2 SW2.2 SW3.2 SW3.2 SW4.2 SW4.2 SW5.2 SW5.2 SW6.2 SW6.2 SW7.2 SW7.2 ; R16.1 30.99,55.3 v1(30.99,56.83)
  Bottom Layer w0.254: v1(30.99,56.83) 30.99,57.34 30.12,58.2 23.72,58.2 v1(23.62,58.1)
COL2: length 163.5
  Top Layer w0.254: SW14.2 SW14.2 SW13.2 SW13.2 SW12.2 SW12.2 SW11.2 SW11.2 SW10.2 SW10.2 SW9.2 SW9.2 SW8.2 82.31,93.49 75.01,93.49 74.76,93.74 ; v1(74.68,92.9) 74.68,93.66 74.76,93.74 ; v1(20.07,64.45) 20.57,63.94 20.57,63.43 20.07,62.92 19.56,62.92 18.35,64.14 U2.23 ; 74.76,93.74 SW8.2
  Bottom Layer w0.254: v1(20.07,64.45) 20.32,64.19 32.26,64.19 34.04,62.42 ; v1(74.68,92.9) 73.66,93.91 65.02,93.91 34.04,62.92 34.04,62.42 ; R12.1 34.04,62.42
COL3: length 176.6
  Top Layer w0.254: v1(37.42,50.92) 35.75,50.92 R17.1 ; v1(29.29,64.89) 30.31,63.87 v1(35.9,63.87) ; v1(74.76,77.84) SW15.2 SW15.2 SW16.2 SW16.2 SW17.2 SW17.2 SW18.2 SW18.2 SW19.2 SW19.2 SW20.2 SW20.2 SW21.2 SW21.2 ; v1(46.57,61.59) v1(38.69,53.71) ; v1(16.09,63.37) 16.85,63.37 U2.22
  Bottom Layer w0.254: v1(38.69,53.71) 38.69,52.19 v1(37.42,50.92) ; v1(74.76,77.84) 74.76,76.83 59.27,61.33 46.82,61.33 v1(46.57,61.59) 44.28,63.87 v1(35.9,63.87) ; v1(29.29,64.89) 29.04,65.14 17.86,65.14 v1(16.09,63.37)
COL4: length 151.8
  Top Layer w0.254: U2.21 19.36,61.6 v1(19.81,61.15) ; v1(76.79,63.83) SW22.2 SW23.2 SW23.2 SW24.2 SW24.2 SW25.2 SW25.2 SW26.2 SW26.2 SW27.2 SW27.2 SW28.2 SW28.2 ; v1(75.01,64.84) 74.76,64.59 SW22.2 68.44,63.83 64.77,67.5 43.69,67.5 37.34,61.15 35.81,61.15 R13.1
  Bottom Layer w0.254: v1(75.01,64.84) 75.78,64.84 v1(76.79,63.83) ; R13.1 32.77,61.15 v1(19.81,61.15)
COL5: length 154.9
  Top Layer w0.254: R18.1 35.81,48.45 74.42,48.45 SW29.2 SW29.2 SW30.2 SW30.2 SW31.2 SW31.2 SW32.2 SW32.2 SW33.2 SW33.2 SW34.2 SW34.2 SW35.2 SW35.2 ; v1(21.59,54.03) 19.3,56.32 19.3,59.88 18.86,60.33 U2.20
  Bottom Layer w0.254: R18.1 33.27,45.91 29.21,45.91 28.45,46.67 28.45,47.18 27.18,48.45 26.42,48.45 21.59,53.27 v1(21.59,54.03)
COL6: length 164.9
  Top Layer w0.254: v1(74.68,36.12) 74.68,33.84 SW36.2 SW36.2 SW37.2 SW37.2 SW38.2 SW38.2 SW39.2 SW39.2 SW40.2 SW40.2 SW41.2 SW41.2 SW42.2 158.58,38.07 161.63,38.07 162.22,37.48 SW42.2 ; v1(63.25,49.33) 41.02,49.33 37.34,53.02 36.83,53.02 35.81,54.03 35.81,55.56 R14.1 ; U2.19 17.92,59.62 v1(18.54,59.62)
  Bottom Layer w0.254: R14.1 32.77,58.61 26.67,58.61 25.65,59.62 v1(18.54,59.62) ; v1(74.68,36.12) 63.25,47.56 v1(63.25,49.33)
CTRL1: length 44.9
  Top Layer w0.254: U3.8 v1(9.57,38.74) ; v1(18.88,46.01) 19.14,45.76 41.49,45.76 SW43.1 SW43.1
  Bottom Layer w0.254: v1(9.57,38.74) 11.61,38.74 v1(18.88,46.01)
CTRL2: length 44.6
  Top Layer w0.254: U3.7 9.32,40.01 12.11,37.21 12.11,36.45 12.62,35.94 14.07,35.94 15,36.87 40.72,36.87 SW44.1 SW44.1
CTRL3: length 50.3
  Top Layer w0.254: v1(12.88,36.7) 12.62,36.96 12.62,37.47 8.81,41.28 U3.6 ; v1(14.65,34.93) 14.65,34.67 28.72,20.61 SW45.1 SW45.1
  Bottom Layer w0.254: v1(12.88,36.7) v1(14.65,34.93)
CTRL4: length 78.1
  Top Layer w0.254: SW46.1 SW46.1 60.88,19.43 23.29,19.43 v1(22.02,20.7) ; U3.5 7.29,42.55 v1(6.78,42.04)
  Bottom Layer w0.254: v1(22.02,20.7) 6.78,35.94 v1(6.78,42.04)
CTRL5: length 68.6
  Top Layer w0.254: SW47.1 SW47.1 61.86,30.86 54.53,30.86 53.26,32.13 53.26,34.16 49.33,38.1 16.05,38.1 10.34,43.82 U3.4
CTRL6: length 63.5
  Top Layer w0.254: U3.3 8.56,45.09 9.32,45.85 10.84,45.85 12.2,44.49 36.59,44.49 37.1,44.99 61.04,44.99 SW48.1 SW48.1
E1: length 92.7
  Top Layer w0.254: J4.T 93.33,124.71 v1(88.14,124.71)
  Bottom Layer w0.254: U1.14 11.43,104.14 25.65,104.14 41.91,120.4 41.91,120.9 45.47,124.46 87.88,124.46 v1(88.14,124.71)
E2: length 106.4
  Bottom Layer w0.254: U1.15 11.32,101.49 39.49,101.49 40.25,102.25 43.56,102.25 44.06,101.74 83.18,101.74 J5.T
E3: length 120.1
  Bottom Layer w0.254: J6.T 93.2,99.06 46.74,99.06 46.23,99.57 36.32,99.57 35.81,99.06 11.43,99.06 U1.16
E4: length 136.4
  Top Layer w0.254: U1.17 10.16,96.01 v1(19.05,104.9) ; v1(129.43,122.57) 88.28,122.57 v1(85.74,125.11)
  Bottom Layer w0.254: v1(85.74,125.11) 38.49,125.11 19.05,105.66 v1(19.05,104.9) ; v1(129.43,122.57) 129.43,122.59 J7.T
E5: length 169.7
  Top Layer w0.254: U1.20 8.89,88.9 8.89,111.25 17.78,120.14 17.78,124.97 18.54,125.73 86.11,125.73 88.51,123.33 142.87,123.33 J8.T
E6: length 185.5
  Top Layer w0.254: J9.T 155.63,125.81 88.06,125.81 87.63,126.24 17.78,126.24 8.38,116.84 8.38,86.87 U1.21
FP1: length 73.4
  Top Layer w0.254: v1(10.34,37.97) 8.56,37.97 U3.9 ; v1(64.18,53.72) 64.18,56.8 RV1.2
  Bottom Layer w0.254: v1(10.34,37.97) 14.91,33.4 27.35,33.4 42.22,48.27 42.22,50.05 45.9,53.72 v1(64.18,53.72)
FP2: length 73.2
  Top Layer w0.254: v1(45.82,73.46) 36.93,73.46 26.08,62.61 26.08,57.53 21.77,53.21 21,53.21 14.15,46.36 U3.2
  Bottom Layer w0.254: v1(45.82,73.46) 47.09,74.73 64.77,74.73 RV2.2
LED: length 12.8
  Top Layer w0.2: U1.6 25.65,90.17 32.51,97.03 32.51,97.28 33.53,98.3 34.69,98.3 U4.1
LEDCNTRL: length 46.3
  Top Layer w0.2: D1.4 78.8,98.32 v1(78.62,98.32) ; v1(36.71,98.83) 36.46,98.57 U4.20
  Bottom Layer w0.2: v1(36.71,98.83) 37.22,98.32 v1(78.62,98.32)
MAIN: length 74.6
  Top Layer w0.254: RV3.2 64.78,87 60.21,87 35.82,62.61 35.82,62.1 34.81,61.09 34.3,61.09 33.28,60.07 33.28,53.98 33.79,53.47 34.3,53.47 35.32,52.45 35.32,51.44 34.81,50.93 34.05,50.93 31.51,48.39 23.45,48.39 21.92,46.86 17.86,46.86 U3.23
MIDI_IN: length 13.8
  Top Layer w0.2: U4.19 37.41,97.92 R1.1
  Top Layer w0.254: R1.1 45.17,105.68 v1(45.2,105.68)
  Bottom Layer w0.254: U5.6 45.46,105.43 v1(45.2,105.68)
MIDI_OUT: length 44.8
  Top Layer w0.2: U4.18 38.49,97.52 42.05,101.08 42.05,101.58 45.86,105.39 45.86,108.44 48.14,110.73 49.41,110.73 54.49,115.81 54.49,117.84 55.26,118.6 57.54,118.6 58.93,117.21 J3.4
MIDII3: length 28.8
  Top Layer w0.2: U1.0 24.13,76.2 24.13,82.8 25.15,83.82 25.65,83.82 33.02,91.19 33.02,97.28 33.66,97.92 U4.2
MIDIO3: length 24.4
  Top Layer w0.2: U4.3 33.77,97.52 33.39,97.14 33.39,85.46 U1.1
MRC: length 34.3
  Top Layer w0.254: v1(10.16,52.02) 10.16,49.74 U3.1
  Bottom Layer w0.254: U1.23 8.89,78.74 8.89,72.09 10.16,70.82 v1(10.16,52.02)
MRR: length 24.9
  Top Layer w0.254: U1.22 3.48,75.87 3.48,65.53 4.24,64.77 7.42,64.77 U2.1
MUXC1: length 76
  Top Layer w0.254: U3.10 8.56,36.2 v1(9.57,37.21)
  Bottom Layer w0.254: v1(9.57,37.21) 8.3,38.48 8.3,92.58 9.83,94.11 24.26,94.11 U1.8
MUXC2: length 80.5
  Top Layer w0.254: U3.11 7.54,34.93 6.02,36.45 6.02,42.55 v1(6.53,43.05)
  Bottom Layer w0.254: U1.9 24.26,96.65 9.83,96.65 6.53,93.35 v1(6.53,43.05)
MUXC3: length 78
  Top Layer w0.254: U1.10 24.21,99.14 24.21,92.08 v1(24.46,91.82) ; U3.14 18.11,34.93 v1(18.87,35.69) ; v1(23.95,75.57) 23.45,76.07 v1(23.45,82.17)
  Bottom Layer w0.254: v1(23.95,75.57) 23.95,72.26 15.06,63.37 15.06,59.06 24.97,49.15 24.97,41.78 v1(18.87,35.69) ; v1(24.46,91.82) 24.46,90.81 24.21,90.55 24.21,82.93 v1(23.45,82.17)
MUXC4: length 81.8
  Top Layer w0.254: U3.13 18.11,33.66 v1(18.62,34.16) ; U1.11 23.7,101.17 v1(23.7,91.57)
  Bottom Layer w0.254: v1(23.7,91.57) 23.7,83.44 14.3,74.04 14.3,59.06 24.46,48.9 24.46,42.29 18.11,35.94 18.11,34.67 v1(18.62,34.16)
MUXR1: length 38.3
  Top Layer w0.254: v1(14.99,65.28) 13.21,63.5 7.03,63.5 6.53,62.99 6.53,55.12 7.67,53.98 U2.10
  Bottom Layer w0.254: v1(14.99,65.28) 14.99,69.6 U1.2
MUXR2: length 38.1
  Top Layer w0.254: U2.11 8.76,52.71 v1(11.43,55.37) ; v1(17.02,74.17) 17.02,73.15 v1(10.92,67.06)
  Bottom Layer w0.254: U1.3 v1(17.02,74.17) ; v1(10.92,67.06) 10.67,66.8 10.67,56.13 v1(11.43,55.37)
MUXR3: length 40.5
  Top Layer w0.254: U1.4 17.78,77.47 v1(16.08,77.47) ; v1(16.08,53.34) 16.72,53.34 U2.14
  Bottom Layer w0.254: v1(16.08,53.34) 13.29,56.13 13.29,74.68 v1(16.08,77.47)
MUXR4: length 44.1
  Top Layer w0.254: U2.13 17.56,51.64 18.11,51.64 18.87,52.4 v1(18.87,53.16) ; U1.5 17.35,79.58 v1(17.35,78.06)
  Bottom Layer w0.254: v1(18.87,53.16) 13.79,58.24 13.79,74.25 17.35,77.8 v1(17.35,78.06)
ROW1: length 205
  Top Layer w0.254: SW1.1 SW1.1 73.24,102.91 73.24,90.92 SW8.1 74.76,85.03 ; SW15.1 74.76,65.99 76.03,64.72 76.03,60.66 74.74,59.37 ; SW15.1 SW15.1 ; SW15.1 73.49,75.63 73.49,83.25 74.76,84.52 74.76,85.03 ; 74.76,85.03 75.01,84.77 78.1,84.77 SW8.1 ; SW22.1 v1(74.76,49.93) ; SW22.1 SW22.1 ; SW22.1 74.74,59.37 ; U2.9 10.28,55.25 11.04,56.01 14.85,56.01 v1(15.62,55.25) ; R7.1 21.91,51.75 v1(20.38,51.75) ; SW29.1 73.49,43.02 73.49,30.53 SW36.1 SW36.1 ; SW29.1 SW29.1 ; SW29.1 v1(74.76,46.63) ; 74.74,59.37 74.23,59.37 71.44,62.16 67.63,62.16 v1(65.09,59.62)
  Bottom Layer w0.254: v1(15.62,55.25) 18.35,52.51 19.62,52.51 v1(20.38,51.75) ; v1(74.76,49.93) v1(74.76,46.63) ; v1(65.09,59.62) 64.83,59.88 62.55,59.88 61.02,58.35 36.64,58.35 35.62,57.34 35.62,56.83 34.86,56.07 28.26,56.07 R7.1
ROW2: length 226.8
  Top Layer w0.254: SW9.1 96.31,89.65 96.52,89.44 96.61,89.44 96.63,89.46 96.63,89.5 96.31,89.82 88.43,89.82 SW9.1 v1(88.01,86.5) ; SW23.1 v1(88.01,62.63) ; SW23.1 v1(84.16,59.33) 84.16,58.82 82.89,57.55 80.6,57.55 v1(76.79,53.74) ; SW23.1 SW23.1 ; SW16.1 SW16.1 v1(88.01,72.79) ; SW2.1 94.95,104.43 91.57,101.04 ; v1(15.81,59.35) 12.98,56.52 U2.8 ; v1(88.01,32.61) SW37.1 SW37.1 ; 89.28,44.29 SW30.1 84.66,47.64 v1(82.89,47.64) ; 89.28,44.29 SW30.1 ; 89.28,44.29 v1(89.28,43.78) ; 91.57,101.04 88.26,97.74 88.26,96.16 v1(89.79,94.63) ; 91.57,101.04 91.4,101.04 SW2.1
  Bottom Layer w0.254: v1(89.79,94.63) 88.01,92.85 v1(88.01,86.5) v1(88.01,72.79) v1(88.01,62.63) ; v1(88.01,32.61) 89.28,33.88 v1(89.28,43.78) ; v1(84.16,59.33) 83.65,59.33 82.64,60.34 37.68,60.34 37.17,60.85 36.66,60.85 35.65,59.83 35.65,59.58 34.63,58.56 33.87,58.56 31.84,60.6 28.23,60.6 R6.1 26.48,60.36 16.83,60.36 v1(15.81,59.35) ; v1(76.79,53.74) v1(82.89,47.64)
ROW3: length 239.5
  Top Layer w0.254: v1(101.26,85.54) SW10.1 SW10.1 ; v1(22.16,57.65) 18.86,60.96 16.32,60.96 13.15,57.79 U2.7 ; SW3.1 104.05,101.64 104.05,101.03 ; SW3.1 107.45,104.43 104.05,101.03 ; SW24.1 SW24.1 ; SW24.1 100.75,59.83 v1(100.75,62.68) ; SW24.1 v1(101.26,57.04) ; v1(101.26,72.07) SW17.1 SW17.1 ; v1(101.26,47.64) SW31.1 SW31.1 ; v1(101.26,32.4) SW38.1 SW38.1 ; 104.05,101.03 104.05,100.27 103.55,99.76 102.78,99.76 101.26,98.24 v1(101.26,95.19)
  Bottom Layer w0.254: v1(100.75,62.68) 101.26,63.18 v1(101.26,72.07) v1(101.26,85.54) v1(101.26,95.19) ; v1(22.16,57.65) 25.46,54.35 27.24,54.35 ; 101.26,54.5 45.89,54.5 37.25,45.86 36.49,45.86 35.47,46.88 35.47,47.13 34.2,48.4 33.95,48.4 30.9,51.45 30.9,52.47 29.89,53.48 28.11,53.48 27.24,54.35 ; 101.26,54.5 v1(101.26,57.04) ; 101.26,54.5 v1(101.26,47.64) v1(101.26,32.4) ; 27.24,54.35 R8.1
ROW4: length 263.6
  Top Layer w0.254: v1(110.55,59.37) 114.47,59.37 SW25.1 ; 117.16,71.31 117.16,70.04 116.9,69.78 116.65,69.78 114.36,67.5 v1(114.36,67.24) ; 117.16,71.31 117.16,71.71 SW18.1 ; 117.16,71.31 119.42,71.31 SW18.1 ; SW39.1 SW39.1 v1(114.51,32.4) ; 117.16,86.29 117.16,85.02 116.9,84.77 116.65,84.77 114.36,82.48 v1(114.36,82.23) ; 117.16,86.29 117.16,86.75 SW11.1 ; 117.16,86.29 119.37,86.29 SW11.1 ; 117.16,101.28 117.16,101.78 SW4.1 ; 117.16,101.28 119.32,101.28 SW4.1 ; 117.16,101.28 117.16,100.22 114.36,97.43 v1(114.36,95.18) ; U2.6 13.47,59.06 v1(15.81,61.4) ; SW25.1 SW25.1 ; SW25.1 v1(114.51,56.79) ; R9.1 28.26,53.02 28.26,61.15 R5.1 28.26,63.18 v1(35.37,63.18) ; SW32.1 SW32.1 v1(114.51,45.36)
  Bottom Layer w0.254: v1(114.36,95.18) v1(114.36,82.23) v1(114.36,67.24) 114.36,66.99 110.55,63.18 v1(110.55,59.37) 109.28,59.37 107.76,60.89 46.04,60.89 43.75,63.18 v1(35.37,63.18) ; v1(114.51,32.4) v1(114.51,45.36) v1(114.51,56.79) ; v1(15.81,61.4) 16.57,62.16 R5.1
ROW5: length 291
  Top Layer w0.254: SW26.1 132.3,55.9 130.55,55.9 ; SW19.1 SW19.1 v1(127.76,71.91) ; SW5.1 SW5.1 v1(127.76,100.35) ; v1(39.18,43.62) 23.94,43.62 v1(23.68,43.87) ; SW12.1 SW12.1 v1(127.76,86.89) ; v1(127.76,52.35) 127.76,52.6 129.79,54.63 130.05,54.63 130.55,55.14 130.55,55.9 ; v1(9.46,59.88) 8.5,59.88 U2.5 ; 127.6,44.13 127.6,42.86 127.76,42.7 v1(127.76,41.93) ; 127.6,44.13 SW33.1 SW33.1 ; 127.6,44.13 126.81,44.13 125.79,43.11 120.46,43.11 118.68,41.33 v1(100.65,41.33) ; 130.55,55.9 130.55,56.53 SW26.1 ; SW40.1 SW40.1 v1(127.76,32.54) ; R10.1 27.24,50.22 26.48,50.99 20.64,50.99 20.13,50.48 v1(19.11,50.48)
  Bottom Layer w0.254: v1(39.18,43.62) 39.94,42.86 54.42,42.86 63.56,52 77.28,52 84.9,44.38 97.6,44.38 v1(100.65,41.33) ; v1(23.68,43.87) 19.11,48.45 v1(19.11,50.48) 10.73,50.48 8.95,52.26 8.95,59.37 v1(9.46,59.88) ; v1(127.76,32.54) v1(127.76,41.93) v1(127.76,52.35) 127,53.11 127,58.44 127.76,59.21 v1(127.76,71.91) v1(127.76,86.89) v1(127.76,100.35)
ROW6: length 283.6
  Top Layer w0.254: SW41.1 SW41.1 v1(141.01,32.4) ; 142.28,74.36 SW20.1 ; 142.28,74.36 SW20.1 ; 142.28,74.36 v1(142.28,74.87) ; v1(141.01,82.23) 141.01,82.49 143.8,85.28 143.8,86.04 ; SW13.1 145.62,86.04 143.8,86.04 ; 143.8,86.04 143.8,86.6 SW13.1 ; SW27.1 SW27.1 ; SW27.1 v1(141.01,57.04) ; SW27.1 139.95,60.38 124.97,60.38 v1(123.95,59.37) ; v1(25.15,57.59) 24.89,57.34 23.37,57.34 20.57,60.13 20.57,61.4 19.74,62.24 8.69,62.24 U2.4 ; 141,74.35 139.7,74.35 135.13,69.78 130.05,69.78 127,66.73 v1(127,65.46) ; v1(141.01,45.36) SW34.1 SW34.1 ; v1(141.01,100.52) SW6.1 SW6.1
  Bottom Layer w0.254: v1(141.01,32.4) v1(141.01,45.36) v1(141.01,57.04) ; v1(141.01,100.52) v1(141.01,82.23) 141.01,81.22 142.28,79.95 v1(142.28,74.87) ; v1(25.15,57.59) 27.18,55.56 33.27,55.56 R15.1 35.56,55.81 82.55,55.81 85.34,58.61 122.17,58.61 122.94,59.37 v1(123.95,59.37) 123.95,62.42 v1(127,65.46)
ROW7: length 293.7
  Top Layer w0.254: SW14.1 158.58,89.4 160.44,87.53 ; 161.88,44.29 SW35.1 ; 161.88,44.29 163.4,45.81 163.4,54.7 160.61,57.5 ; 161.88,44.29 161.63,44.29 ; SW42.1 159.55,29.26 160.86,30.57 ; 160.61,57.5 158.78,59.33 SW28.1 ; 160.61,57.5 160.61,57.72 SW28.1 163.49,60.6 163.49,69.49 160.44,72.53 ; 160.44,87.53 163.49,84.48 163.49,75.63 SW21.1 160.44,72.58 160.44,72.53 ; 160.44,87.53 160.44,87.62 SW14.1 163.49,90.67 163.49,99.56 160.44,102.6 ; SW21.1 158.62,74.36 160.44,72.53 ; SW7.1 160.44,102.65 160.44,102.6 ; SW42.1 160.9,30.57 160.86,30.57 ; v1(37.4,44.38) 71.69,44.38 74.74,47.43 81.6,47.43 86.01,43.02 110.39,43.02 113.95,46.58 151.97,46.58 SW35.1 161.63,44.29 ; 161.63,44.29 163.4,42.51 163.4,33.11 160.86,30.57 ; SW7.1 158.62,104.43 160.44,102.6 ; v1(12,62.87) U2.3 ; v1(23.68,47.68) 24.45,46.92 R11.1
  Bottom Layer w0.254: R11.1 29.78,44.38 v1(37.4,44.38) ; v1(23.68,47.68) 23.43,47.68 19.11,52 16.57,52 12,56.57 v1(12,62.87)
SCL: length 36
  Top Layer w0.254: v1(31.24,90.42) 29.72,88.9 11.43,88.9 U1.19
  Bottom Layer w0.254: v1(31.24,90.42) 32.51,91.69 42.67,91.69 display.3
SDA: length 38.3
  Bottom Layer w0.254: display.4 44.7,92.2 30.23,92.2 28.45,93.98 25.15,93.98 23.88,92.71 U1.18
$1N1: length 79.9
  Top Layer w0.254: v1(90.13,34.48) 90.39,34.73 153.25,34.73 D35.2 ; v1(87.34,30.92) 86.58,30.92 D36.4
  Bottom Layer w0.254: v1(90.13,34.48) 90.13,33.71 v1(87.34,30.92)
$1N4: length 20.1
  Top Layer w0.254: D15.2 77.05,66.58 90.38,66.58 D16.4
$1N5: length 9.7
  Top Layer w0.254: D26.3 139.24,52.31 D27.1
$1N6: length 16.6
  Bottom Layer w0.254: 56.63,104.92 57.12,105.41 D43.1 ; 56.63,104.92 U5.2 ; 56.63,104.92 56.63,105.18 55.11,106.7 54.06,106.7 R3.1
$1N7: length 9.7
  Top Layer w0.254: D29.3 86.24,37.27 D30.1
$1N8: length 9.7
  Top Layer w0.254: D5.1 129.07,100.71 125.77,97.41 D4.3
$1N11: length 9.7
  Top Layer w0.254: D23.3 99.49,52.31 D24.1
$1N12: length 9.7
  Top Layer w0.254: D4.1 112.74,97.41 D3.3
$1N13: length 20.1
  Top Layer w0.254: D23.4 93.68,56.37 84.67,56.37 83.15,54.85 78.83,54.85 D22.2
$1N15: length 9.7
  Top Layer w0.254: D37.1 86.24,22.24 D36.3
$1N17: length 9.7
  Top Layer w0.254: D12.1 125.99,82.38 D11.3
$1N19: length 9.7
  Top Layer w0.254: D32.1 112.74,37.27 D31.3
$1N20: length 9.7
  Top Layer w0.254: D18.3 125.99,67.34 D19.1
$1N23: length 20.1
  Top Layer w0.254: D35.4 159.93,41.33 146.6,41.33 D34.2
$1N24: length 2.9
  Bottom Layer w0.254: R4.2 78.66,114.38 J3.5
$1N25: length 9.7
  Top Layer w0.254: D10.3 112.74,82.38 D11.1
$1N26: length 9.7
  Top Layer w0.254: D21.1 152.49,67.34 D20.3
$1N27: length 9.7
  Top Layer w0.254: D38.3 112.74,22.24 D39.1
$1N29: length 9.7
  Top Layer w0.254: D17.3 112.74,67.34 D18.1
$1N30: length 90.9
  Top Layer w0.254: D7.3 159.73,98.38 155.03,98.38 152.74,96.09 128.11,96.09 v1(127.09,97.11) ; D8.1 83.4,92.79 94.07,92.79 v1(94.58,93.3)
  Bottom Layer w0.254: v1(94.58,93.3) 98.39,97.11 v1(127.09,97.11)
$1N31: length 9.7
  Top Layer w0.254: D9.3 99.01,82.38 102.31,85.68 D10.1
$1N32: length 20.1
  Top Layer w0.254: D14.4 159.93,86.44 146.6,86.44 D13.2
$1N33: length 9.7
  Top Layer w0.254: D33.1 125.99,37.27 D32.3
$1N34: length 9.7
  Top Layer w0.254: D16.1 86.24,67.34 D15.3
$1N37: length 9.7
  Top Layer w0.254: D5.3 139.24,97.41 D6.1
$1N38: length 20.1
  Top Layer w0.254: D20.4 146.68,71.4 137.42,71.4 135.39,69.37 131.32,69.37 D19.2
$1N39: length 20.1
  Top Layer w0.254: D20.2 145.08,69.88 149.4,69.88 150.92,71.4 159.93,71.4 D21.4
$1N40: length 90.1
  Top Layer w0.254: D36.1 77.26,24.57 81.95,24.57 84.24,26.86 150.02,26.86 160.44,37.27 D35.3
$1N43: length 9.7
  Top Layer w0.254: D25.1 114.77,54.34 109.72,54.34 D24.3
$1N45: length 82.6
  Top Layer w0.254: D22.4 82.51,56.93 95.59,56.93 97.12,58.45 97.12,62.01 v1(96.61,62.51) ; D21.2 153.25,64.8 98.89,64.8 v1(98.64,64.55)
  Bottom Layer w0.254: v1(98.64,64.55) v1(96.61,62.51)
$1N46: length 20.1
  Top Layer w0.254: D32.2 120.1,41.33 133.43,41.33 D33.4
$1N51: length 20.1
  Top Layer w0.254: D12.2 130.05,81.61 143.38,81.61 D13.4
$1N54: length 9.7
  Top Layer w0.254: D6.3 152.49,97.41 D7.1
$1N56: length 79.5
  Top Layer w0.254: D15.4 82.51,71.96 82.89,71.96 88.48,77.55 v1(148.17,77.55) ; D14.2 153,82.38 v1(150.2,79.58)
  Bottom Layer w0.254: v1(150.2,79.58) v1(148.17,77.55)
$1N57: length 20.1
  Top Layer w0.254: D36.2 77.05,21.47 90.38,21.47 D37.4
$1N58: length 9.7
  Top Layer w0.254: D9.1 84.49,85.68 D8.3
$1N59: length 9.7
  Top Layer w0.254: D40.3 139.24,22.24 D41.1
$1N60: length 9.7
  Top Layer w0.254: D13.3 150.74,85.68 D14.1
$1N61: length 79.5
  Top Layer w0.254: v1(151.68,93.3) 150.41,92.03 87.54,92.03 D8.4 ; v1(152.94,94.57) D7.2
  Bottom Layer w0.254: v1(151.68,93.3) v1(152.94,94.57)
$1N62: length 9.7
  Top Layer w0.254: D33.3 139.24,37.27 D34.1
$1N63: length 9.7
  Top Layer w0.254: D42.1 152.49,22.24 D41.3
$1N64: length 9.7
  Top Layer w0.254: D26.1 125.99,52.31 D25.3
$1N65: length 9.7
  Top Layer w0.254: D30.3 97.74,40.57 D31.1
$1N66: length 20.1
  Top Layer w0.254: D33.2 130.05,36.51 143.38,36.51 D34.4
$1N68: length 9.7
  Top Layer w0.254: D16.3 99.49,67.34 D17.1
$1N70: length 98.6
  Top Layer w0.254: D21.3 159.93,68.1 154.85,68.1 152.31,65.56 v1(132.75,65.56) ; v1(127.67,58.2) 122.59,53.12 110.14,53.12 108.37,51.34 75.48,51.34 75.22,51.59 75.22,54.54 D22.1
  Bottom Layer w0.254: v1(127.67,58.2) 132.75,63.28 v1(132.75,65.56)
$1N71: length 9.7
  Top Layer w0.254: D2.3 99.49,97.41 D3.1
$1N74: length 9.7
  Top Layer w0.254: D1.3 86.24,97.41 D2.1
$1N75: length 20.1
  Top Layer w0.254: D31.2 103.55,36.51 116.88,36.51 D32.4
$1N78: length 46.1
  Top Layer w0.254: D3.4 103.49,96.51 101.99,96.51 101.73,96.76 101.73,98.03 103,99.3 103.76,99.3 106.56,102.1 108.84,102.1 110.37,103.62 110.37,105.14 110.11,105.4 100.32,105.4 99.95,105.03 99.95,104.52 92.84,97.41 D2.2
$1N79: length 9.7
  Top Layer w0.254: D28.1 154.52,54.34 149.47,54.34 D27.3
$1N82: length 9.7
  Top Layer w0.254: D34.3 152.49,37.27 D35.1
$1N90: length 79.5
  Top Layer w0.254: v1(150.2,49.51) 153,52.31 D28.2 ; v1(146.65,45.96) 114.13,45.96 110.32,42.15 82.77,42.15 D29.4
  Bottom Layer w0.254: v1(150.2,49.51) v1(146.65,45.96)
$1N92: length 9.7
  Top Layer w0.254: D20.1 139.24,67.34 D19.3
$1N93: length 20.1
  Top Layer w0.254: D17.2 103.55,66.58 116.88,66.58 D18.4
$1N94: length 20.1
  Top Layer w0.254: D25.2 116.8,51.54 130.13,51.54 D26.4
$1N96: length 9.7
  Top Layer w0.254: D38.1 99.49,22.24 D37.3
$1N97: length 15.4
  Top Layer w0.254: U5.3 59.57,110.4 D43.2 59.57,113.44 J2.5
$1N107: length 9.7
  Top Layer w0.254: D22.3 86.24,52.31 D23.1
$1N108: length 9.7
  Top Layer w0.254: D40.1 125.99,22.24 D39.3
$1N112: length 29.8
  Top Layer w0.254: D4.4 123.62,103.39 123.62,105.14 123.36,105.4 113.57,105.4 109.65,101.47 106.85,101.47 D3.2
$1N121: length 20.1
  Top Layer w0.254: D27.4 146.68,56.37 133.35,56.37 D26.2
$1N123: length 9.7
  Top Layer w0.254: D13.1 139.24,82.38 D12.3
$1N124: length 20.1
  Top Layer w0.254: D5.4 133.43,99.95 128.99,99.95 125.69,96.65 116.8,96.65 D4.2
$1N125: length 20.1
  Top Layer w0.254: D29.2 78.83,39.81 83.15,39.81 84.67,41.33 93.68,41.33 D30.4
$1N126: length 20.1
  Top Layer w0.254: D39.2 120.1,26.3 133.43,26.3 D40.4
$1N127: length 20.4
  Top Layer w0.254: D19.4 133.43,71.4 128.23,71.4 127.98,71.15 122.14,71.15 121.88,71.4 120.1,71.4 D18.2
$1N128: length 20.1
  Top Layer w0.254: D6.4 144.17,100.71 140.1,96.65 130.05,96.65 D5.2
$1N131: length 20.4
  Top Layer w0.254: D11.2 120.1,86.44 121.88,86.44 122.14,86.19 127.98,86.19 128.23,86.44 133.43,86.44 D12.4
$1N132: length 92.4
  Top Layer w0.254: v1(85.51,79.58) 85.76,79.84 147.99,79.84 151.29,83.14 159.93,83.14 D14.3 ; D15.1 78.12,72.47 82.71,72.47 83.98,73.74 v1(83.98,78.06)
  Bottom Layer w0.254: v1(85.51,79.58) v1(83.98,78.06)
$1N133: length 20.1
  Top Layer w0.254: D24.4 106.93,56.37 97.92,56.37 96.4,54.85 92.08,54.85 D23.2
$1N134: length 20.1
  Top Layer w0.254: D30.2 90.3,36.51 98.94,36.51 102.24,39.81 106.93,39.81 D31.4
$1N136: length 20.1
  Top Layer w0.254: D27.2 145.08,54.85 153.21,54.85 154.73,56.37 159.93,56.37 D28.4
$1N138: length 98.1
  Top Layer w0.254: D29.1 75.22,39.5 75.22,36.56 75.73,36.05 99.48,36.05 v1(102.52,39.1) ; D28.3 159.93,53.07 151.29,53.07 147.99,49.77 112.18,49.77 v1(111.92,49.51)
  Bottom Layer w0.254: v1(102.52,39.1) 111.92,48.5 v1(111.92,49.51)
$1N139: length 20.1
  Top Layer w0.254: D8.2 77.05,81.61 82.13,81.61 85.43,84.92 93.68,84.92 D9.4
$1N141: length 20.1
  Top Layer w0.254: D6.2 145.08,99.95 153.21,99.95 154.73,101.47 159.93,101.47 D7.4
$1N142: length 20.1
  Top Layer w0.254: D37.2 93.6,26.3 106.93,26.3 D38.4
$1N144: length 20.1
  Top Layer w0.254: D41.2 146.6,26.3 159.93,26.3 D42.4
$1N145: length 20.1
  Top Layer w0.254: D40.2 130.05,21.47 143.38,21.47 D41.4
$1N146: length 20.1
  Top Layer w0.254: D17.4 106.93,71.4 93.6,71.4 D16.2
$1N147: length 30
  Top Layer w0.254: D2.4 97.23,103.5 97.23,105.03 96.72,105.54 87.21,105.54 84.94,103.27 82.15,103.27 D1.2
$1N148: length 20.1
  Top Layer w0.254: D9.2 90.3,81.61 98.94,81.61 102.24,84.92 106.93,84.92 D10.4
$1N149: length 20.1
  Top Layer w0.254: D38.2 103.55,21.47 116.88,21.47 D39.4
$1N151: length 20.1
  Top Layer w0.254: D10.2 103.55,81.61 116.88,81.61 D11.4
$1N152: length 20.1
  Top Layer w0.254: D24.2 105.33,54.85 113.46,54.85 114.98,56.37 120.18,56.37 D25.4
$1N2399: length 5.4
  Bottom Layer w0.254: U5.7 46.97,102.89 R2.2
$1N2400: length 5.7
  Bottom Layer w0.254: R3.2 45.8,112.42 J2.4

## Text on the board
Document Layer: MOARkNOBS-42
Top Layer: v2 | brain | MOAR k NOBS - 42 | PWR | MIDI OUT | MAIN | MIDI IN | f2 | f1 | 1x1 | EF1 | EF2 | EF3 | EF4 | EF5 | EF6 | 7x6 | \\  |  / / CNTRL / /  |  \\
